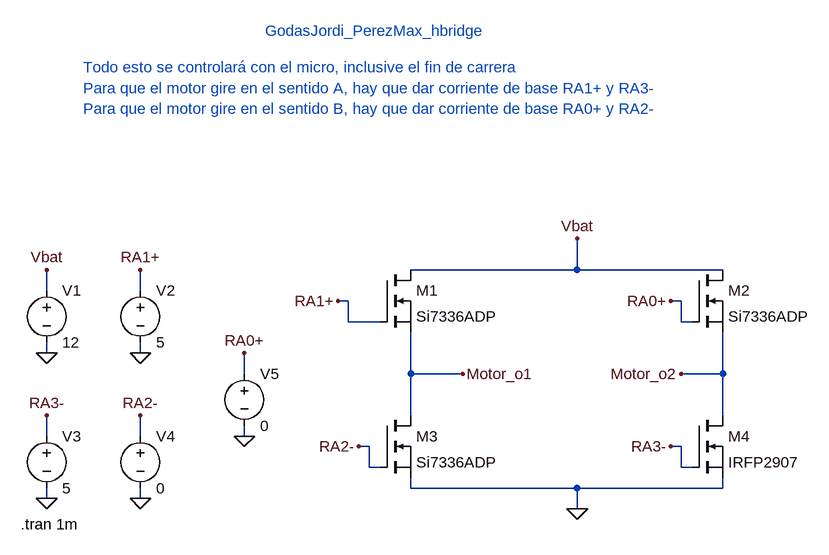
[diagram p0: schematic h_bridge.asc]
h_bridge.asc, the LTspice schematic file:
Version 4
SHEET 1 1880 680
WIRE 1040 -272 1040 -320
WIRE 1040 -272 784 -272
WIRE 1264 -272 1040 -272
WIRE 224 -240 224 -272
WIRE 368 -240 368 -272
WIRE 688 -224 672 -224
WIRE 1200 -224 1184 -224
WIRE 688 -192 688 -224
WIRE 736 -192 688 -192
WIRE 1200 -192 1200 -224
WIRE 1216 -192 1200 -192
WIRE 224 -144 224 -160
WIRE 368 -144 368 -160
WIRE 528 -112 528 -144
WIRE 784 -112 784 -176
WIRE 864 -112 784 -112
WIRE 1264 -112 1264 -176
WIRE 1264 -112 1200 -112
WIRE 784 -48 784 -112
WIRE 1264 -48 1264 -112
WIRE 224 -16 224 -48
WIRE 368 -16 368 -48
WIRE 528 -16 528 -32
WIRE 720 0 704 0
WIRE 1200 0 1184 0
WIRE 720 32 720 0
WIRE 736 32 720 32
WIRE 1200 32 1200 0
WIRE 1216 32 1200 32
WIRE 784 64 784 48
WIRE 1040 64 784 64
WIRE 1264 64 1264 48
WIRE 1264 64 1040 64
WIRE 224 80 224 64
WIRE 368 80 368 64
WIRE 1040 96 1040 64
FLAG 864 -112 Motor_o1
FLAG 1200 -112 Motor_o2
FLAG 1040 -320 Vbat
FLAG 1040 96 0
FLAG 224 -144 0
FLAG 224 -272 Vbat
FLAG 672 -224 RA1+
FLAG 1184 -224 RA0+
FLAG 704 0 RA2-
FLAG 1184 0 RA3-
FLAG 368 -144 0
FLAG 368 -272 RA1+
FLAG 224 80 0
FLAG 224 -48 RA3-
FLAG 368 80 0
FLAG 368 -48 RA2-
FLAG 528 -16 0
FLAG 528 -144 RA0+
SYMBOL nmos 736 -272 R0
SYMATTR InstName M1
SYMATTR Value Si7336ADP
SYMBOL nmos 1216 -272 R0
SYMATTR InstName M2
SYMATTR Value Si7336ADP
SYMBOL nmos 736 -48 R0
SYMATTR InstName M3
SYMATTR Value Si7336ADP
SYMBOL nmos 1216 -48 R0
SYMATTR InstName M4
SYMATTR Value IRFP2907
SYMBOL voltage 224 -256 R0
WINDOW 123 0 0 Left 0
WINDOW 39 0 0 Left 0
SYMATTR InstName V1
SYMATTR Value 12
SYMBOL voltage 368 -256 R0
WINDOW 123 0 0 Left 0
WINDOW 39 0 0 Left 0
SYMATTR InstName V2
SYMATTR Value 5
SYMBOL voltage 224 -32 R0
WINDOW 123 0 0 Left 0
WINDOW 39 0 0 Left 0
SYMATTR InstName V3
SYMATTR Value 5
SYMBOL voltage 368 -32 R0
WINDOW 123 0 0 Left 0
WINDOW 39 0 0 Left 0
SYMATTR InstName V4
SYMATTR Value 0
SYMBOL voltage 528 -128 R0
WINDOW 123 0 0 Left 0
WINDOW 39 0 0 Left 0
SYMATTR InstName V5
SYMATTR Value 0
TEXT 184 120 Left 2 !.tran 1m
TEXT 560 -640 Left 2 ;GodasJordi_PerezMax_hbridge
TEXT 280 -552 Left 2 ;Para que el motor gire en el sentido A, hay que dar corriente de base RA1+ y RA3-
TEXT 280 -520 Left 2 ;Para que el motor gire en el sentido B, hay que dar corriente de base RA0+ y RA2-
TEXT 280 -584 Left 2 ;Todo esto se controlará con el micro, inclusive el fin de carrera

The netlist it stands for:
* h_bridge.asc
M1 Vbat RA1+ Motor_o1 Motor_o1 Si7336ADP
M2 Vbat RA0+ Motor_o2 Motor_o2 Si7336ADP
M3 Motor_o1 RA2- 0 0 Si7336ADP
M4 Motor_o2 RA3- 0 0 IRFP2907
V1 Vbat 0 12
V2 RA1+ 0 5
V3 RA3- 0 5
V4 RA2- 0 0
V5 RA0+ 0 0
.model NMOS NMOS
.model PMOS PMOS
.lib standard.mos
.tran 1m
* GodasJordi_PerezMax_hbridge
* Para que el motor gire en el sentido A, hay que dar corriente de base RA1+ y RA3-
* Para que el motor gire en el sentido B, hay que dar corriente de base RA0+ y RA2-
* Todo esto se controlará con el micro, inclusive el fin de carrera
.backanno
.end